# EAGLE design RJ11Breakout (EAGLE 7.5.0)
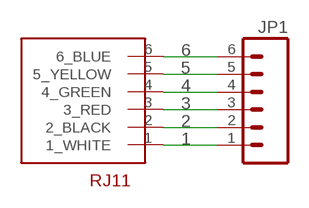
[diagram p0: schematic, sheet 1]

## Parts
JP1  M06SILK_FEMALE_PTH  [1X06]
U$7  RJ12  [RJ12]

## Nets
1: JP1.1 U$7.1(1_WHITE)
2: JP1.2 U$7.2(2_BLACK)
3: JP1.3 U$7.3(3_RED)
4: JP1.4 U$7.4(4_GREEN)
5: JP1.5 U$7.5(5_YELLOW)
6: JP1.6 U$7.6(6_BLUE)

## Library data of the parts
JP1 = SparkFun-Connectors:M06: Header 6 Standard 6-pin 0.1" header. Use with straight break away headers (SKU : PRT-00116), right angle break away headers (PRT-00553), swiss pins (PRT-00743), machine pins (PRT-00117), and female headers (PRT-00115). Molex polarized connector foot print use with SKU : PRT-08094 with associated crimp pins and housings. NOTES ON THE VARIANTS LOCK and LOCK_LONGPADS... This footprint was designed to help hold the alignment of a through-hole component (i.e. 6-pin header) while soldering it into place. You may notice that each hole has been shifted either up or down by 0.005 of an inch from it's more standard position (which is a perfectly straight line). This slight alteration caused the pins (the squares in the middle) to touch the edges of the holes. Because they are alternating, it causes a "brace" to hold the component in place. 0.005 has proven to be the perfect amount of "off-center" position when using our standard breakaway headers. Although looks a little odd when you look at the bare footprint, once you have a header in there, the alteration is very hard to notice. Also,if you push a header all the way into place, it is covered up entirely on the bottom side. This idea of altering the position of holes to aid alignment will be further integrated into the Sparkfun Library for other footprints. It can help hold any component with 3 or more connection pins.; PROD_ID: CONN-08437
U$7 = barbary_enterprises:RJ12

## Board
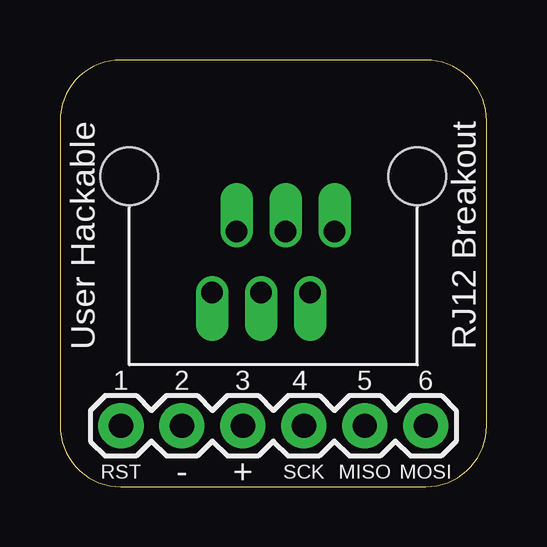
[diagram p1: board, top side]
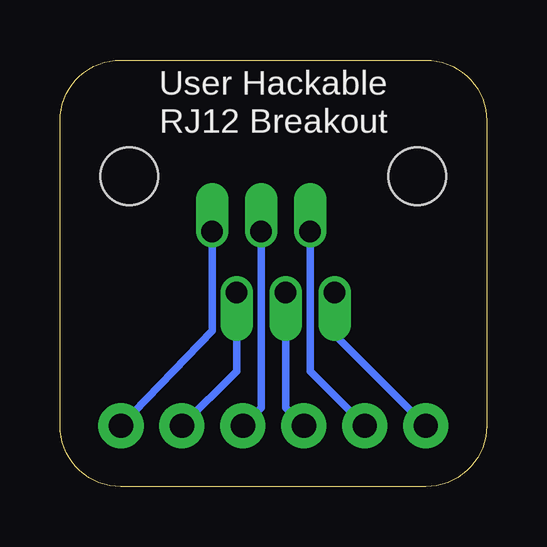
[diagram p2: board, bottom side, seen from below]

Size 17.78 x 17.78 mm. Coordinates in mm from the lower left corner, seen from the top.
Outline: 17.78,2.54 17.78,15.24 arc90 15.24,17.78 2.54,17.78 arc90 0,15.24 0,2.54 arc90 2.54,0 15.24,0 arc90 17.78,2.54
Copper layers (1*16): Top 0.0356mm / dielectric 1.5011mm / Bottom 0.0356mm
Design rules "LaenPCBOrder": minimum track width 6mil, minimum drill 13mil, track to track 6mil, track to pad 6mil, pad to pad 6mil, via to via 6mil, smd to smd 6mil, copper to edge 15mil, drill to drill 6mil, minimum pad ring 7mil, minimum via ring 7mil, stop-mask expansion 3mil, vias tented up to drill 0mil, thermal gap 10mil

### Footprints (pad centres in the part's own frame; a part is rotated, then mirrored left to right if it is on the bottom)
1X06 = drill 1.016 pad 1.88: 1 0,0; 2 2.54,0; 3 5.08,0; 4 7.62,0; 5 10.16,0; 6 12.7,0
RJ12 = drill 0.9 offset: 1 2.55,2.54; 2 1.53,0; 3 0.51,2.54; 4 -0.51,0; 5 -1.53,2.54; 6 -2.55,0 | hole 2.4: 6,-2.3; -6,-2.3

### Placement (x,y rotation side)
JP1  2.54,2.54 0 top
U$7  8.89,10.64 180 top

### Tracks (layer width: path | path; a pad name or v marks a point on that pad's centre or on a via)
1
  Bottom 0.305: U$7.1 6.34,6.34 JP1.1
2
  Bottom 0.305: U$7.2 7.36,4.82 JP1.2
3
  Bottom 0.305: U$7.3 8.38,3.3 JP1.3
4
  Bottom 0.305: U$7.4 9.4,3.3 JP1.4
5
  Bottom 0.305: U$7.5 10.42,4.82 JP1.5
6
  Bottom 0.305: U$7.6 11.44,6.5 JP1.6

### Text on the board
tPlace: User Hackable | RJ12 Breakout | 1 | 2 | 3 | 4 | 5 | 6 | RST | - | + | SCK | MISO | MOSI
bPlace: User Hackable | RJ12 Breakout